# Altium schematic sheet FRC0603F1000TS.schdoc
size 127 x 101 mm
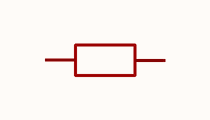
[diagram p0: FRC0603F1000TS.schdoc]

## Parts
R?  frc0603f1000ts  [R0603]  (value not drawn)

## Nets

Not connected (* = marked no-connect by the designer): R? 1 2

## Library data of the parts
R? = frc0603f1000ts: 电阻类型:厚膜电阻;阻值:100Ω;精度:±1%;功率:100mW;工作电压:75V;温度系数:±100ppm/℃;; Manufacturer: FOJAN(富捷); AddInBom: yes; ModelId: fc143cca1e79419f9cd78b61e9279f08; ModelTransform: 31.8897,63.7794,0,90,0,0,0,0,0; Value: 100Ω; Tolerance: ±1%; Power(Watts): 100mW; Voltage-Supply(Max): 75V; Symbol: FRC0603F1000TS; LCSC Part Name: 100Ω ±1% 100mW 厚膜电阻; SupplierPart: C2906981; ManufacturerPart: FRC0603F1000TS; Supplier Footprint: 0603; JLCPCB Part Class: Extended Part; Datasheet: https://item.szlcsc.com/datasheet/FRC0603F1000TS/3180494.html; Supplier: LCSC; ConvertToPcb: yes; FootprintName: R0603; ModelName: R0603; Type: 厚膜电阻; Temperature Coefficient: ±100ppm/℃; Operating Temperature: -55℃~+155℃